# Altium schematic sheet Camera.SchDoc
size 594 x 420 mm; Address1: Address1; Address2: Address2; Address3: Address3; Address4: Address4; SheetNumber: 10; SheetTotal: 11; Scale: 1:1; Обозначение документа: Camera-Sensor-Project; Номер листа: 10
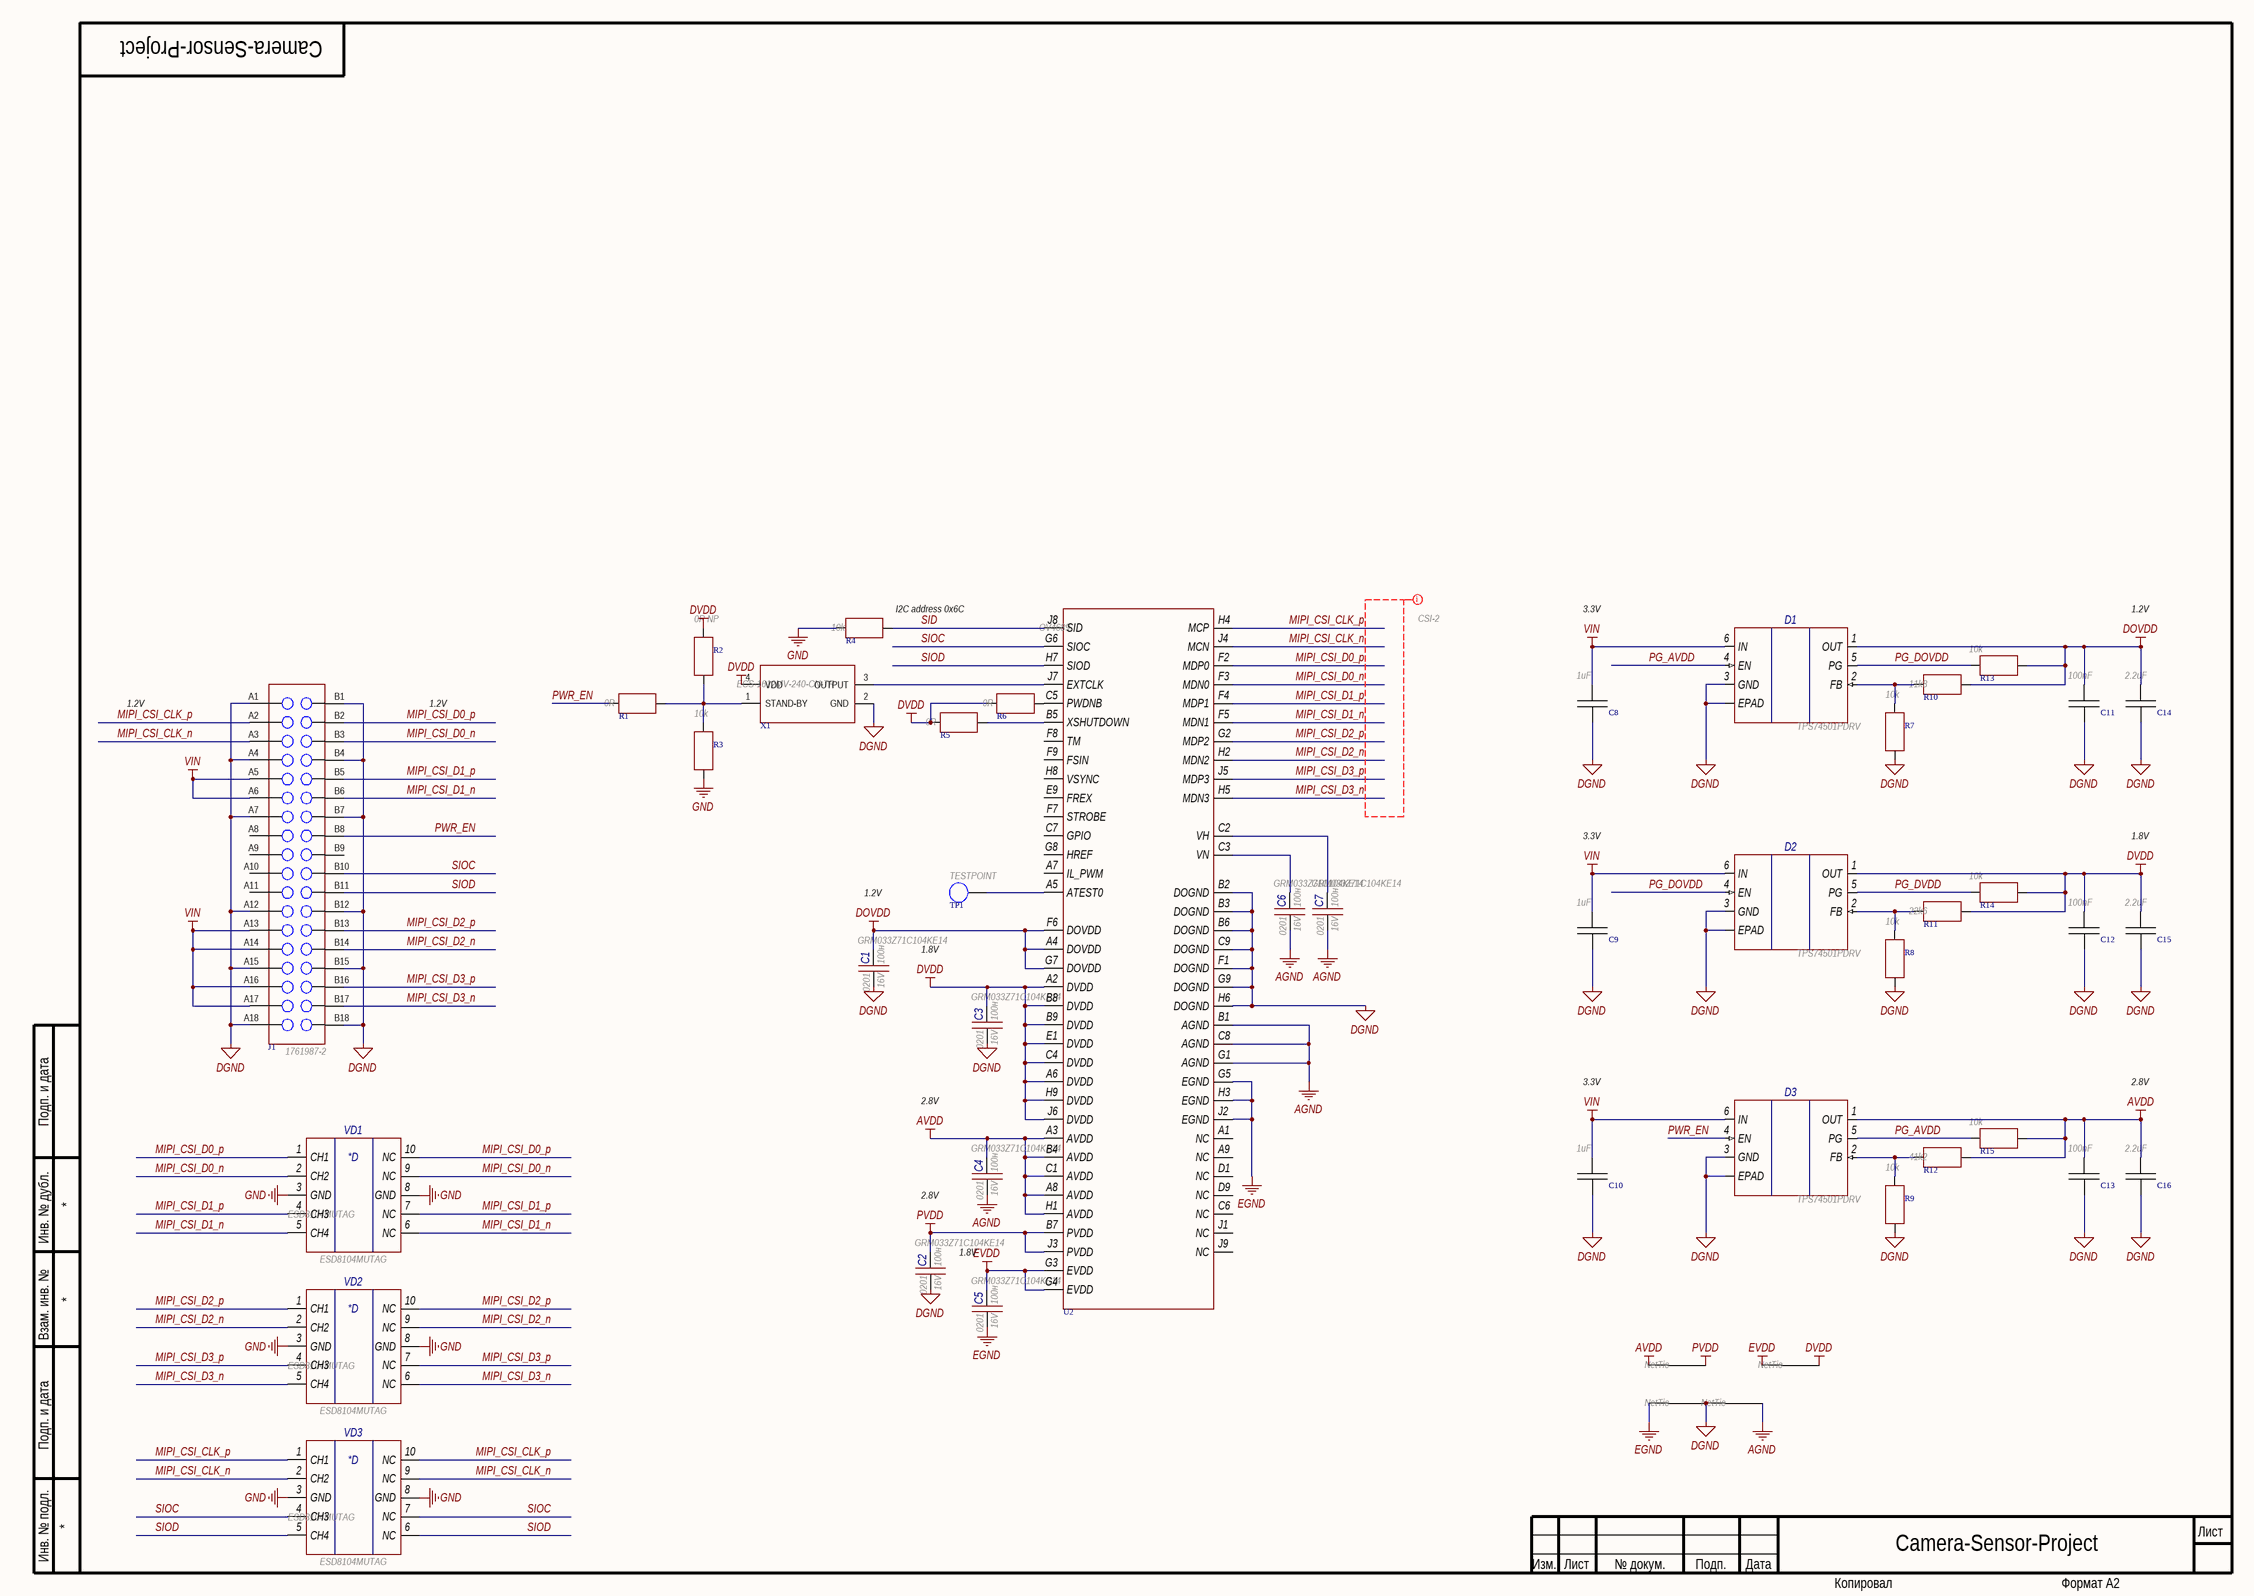
[diagram p0: Camera.SchDoc]

## Parts
C1  GRM033Z71C104KE14  2) Package: 0201  3) Voltage: 16V  Значение: 100н  [CAPC_0.63x0.33x0.33Body; IPC: N; Pad Gap: 0.25]
C2  GRM033Z71C104KE14  2) Package: 0201  3) Voltage: 16V  Значение: 100н  [CAPC_0.63x0.33x0.33Body; IPC: N; Pad Gap: 0.25]
C3  GRM033Z71C104KE14  2) Package: 0201  3) Voltage: 16V  Значение: 100н  [CAPC_0.63x0.33x0.33Body; IPC: N; Pad Gap: 0.25]
C4  GRM033Z71C104KE14  2) Package: 0201  3) Voltage: 16V  Значение: 100н  [CAPC_0.63x0.33x0.33Body; IPC: N; Pad Gap: 0.25]
C5  GRM033Z71C104KE14  2) Package: 0201  3) Voltage: 16V  Значение: 100н  [CAPC_0.63x0.33x0.33Body; IPC: N; Pad Gap: 0.25]
C6  GRM033Z71C104KE14  2) Package: 0201  3) Voltage: 16V  Значение: 100н  [CAPC_0.63x0.33x0.33Body; IPC: N; Pad Gap: 0.25]
C7  GRM033Z71C104KE14  2) Package: 0201  3) Voltage: 16V  Значение: 100н  [CAPC_0.63x0.33x0.33Body; IPC: N; Pad Gap: 0.25]
C8  1uF  [C0603]
C9  1uF  [C0603]
C10  1uF  [C0603]
C11  100nF  [C0603]
C12  100nF  [C0603]
C13  100nF  [C0603]
C14  2.2uF  [C0603]
C15  2.2uF  [C0603]
C16  2.2uF  [C0603]
D1  TPS74501PDRV  [WSON6_2.1x2.1x0.8Body; Recommended: Texas Instruments]
D2  TPS74501PDRV  [WSON6_2.1x2.1x0.8Body; Recommended: Texas Instruments]
D3  TPS74501PDRV  [WSON6_2.1x2.1x0.8Body; Recommended: Texas Instruments]
J1  1761987-2  [CON: 36_1761987-2_TEC]
JT1  NetTie  [CON: nettie_0.8]  (net tie, no BOM)
JT2  NetTie  [CON: nettie_0.8]  (net tie, no BOM)
JT3  NetTie  [CON: nettie_0.8]  (net tie, no BOM)
JT4  NetTie  [CON: nettie_0.8]  (net tie, no BOM)
R1  0R  [R0603]
R2  0R NP  [R0603]
R3  10k  [R0603]
R4  10k  [R0603]
R5  0R  [R0603]
R6  0R  [R0603]
R7  10k  [R0603]
R8  10k  [R0603]
R9  10k  [R0603]
R10  11k8  [R0603]
R11  22k6  [R0603]
R12  41k2  [R0603]
R13  10k  [R0603]
R14  10k  [R0603]
R15  10k  [R0603]
TP1  TESTPOINT  [TP]
U2  OV4689  [81-BGA-OMNIVISION4669]
VD1  ESD8104MUTAG  [UDFN10_1.0x2.5x0.55Body; Recommended: onsemi]
VD2  ESD8104MUTAG  [UDFN10_1.0x2.5x0.55Body; Recommended: onsemi]
VD3  ESD8104MUTAG  [UDFN10_1.0x2.5x0.55Body; Recommended: onsemi]
X1  ECS-1612MV-240-CN-TR  [DFN1.6X1.2]

## Nets
AGND: C4.1 C6.1 C7.1 JT3.2 U2.B1(AGND) U2.C8(AGND) U2.G1(AGND)
AVDD: C4.2 C13.2 C16.2 D3.1(OUT) JT1.1 R12.2 R15.1 U2.A3(AVDD) U2.A8(AVDD) U2.B4(AVDD) U2.C1(AVDD) U2.H1(AVDD)
DGND: C1.1 C2.1 C3.1 C8.1 C9.1 C10.1 C11.1 C12.1 C13.1 C14.1 C15.1 C16.1 D1.3(GND) D1.EPAD D2.3(GND) D2.EPAD D3.3(GND) D3.EPAD J1.A1 J1.A4 J1.A7 J1.A12 J1.A15 J1.A18 J1.B1 J1.B4 J1.B7 J1.B12 J1.B15 J1.B18 JT2.2 JT3.1 R7.1 R8.1 R9.1 U2.B2(DOGND) U2.B3(DOGND) U2.B6(DOGND) U2.C9(DOGND) U2.F1(DOGND) U2.G9(DOGND) U2.H6(DOGND) X1.2(GND)
DOVDD: C1.2 C11.2 C14.2 D1.1(OUT) R10.2 R13.1 U2.A4(DOVDD) U2.F6(DOVDD) U2.G7(DOVDD)
DVDD: C3.2 C12.2 C15.2 D2.1(OUT) JT4.2 R2.2 R5.1 R6.1 R11.2 R14.1 U2.A2(DVDD) U2.A6(DVDD) U2.B8(DVDD) U2.B9(DVDD) U2.C4(DVDD) U2.E1(DVDD) U2.H9(DVDD) U2.J6(DVDD) X1.4(VDD)
EGND: C5.1 JT2.1 U2.G5(EGND) U2.H3(EGND) U2.J2(EGND)
EVDD: C5.2 JT4.1 U2.G3(EVDD) U2.G4(EVDD)
GND: R3.1 R4.1 VD1.3(GND) VD1.8(GND) VD2.3(GND) VD2.8(GND) VD3.3(GND) VD3.8(GND)
PVDD: C2.2 JT1.2 U2.B7(PVDD) U2.J3(PVDD)
VIN: C8.2 C9.2 C10.2 D1.6(IN) D2.6(IN) D3.6(IN) J1.A5 J1.A6 J1.A13 J1.A14 J1.A16 J1.A17
MIPI_CSI_CLK_n: J1.A3 U2.J4(MCN) VD3.2(CH2) VD3.9(NC)
MIPI_CSI_CLK_p: J1.A2 U2.H4(MCP) VD3.1(CH1) VD3.10(NC)
MIPI_CSI_D0_n: J1.B3 U2.F3(MDN0) VD1.2(CH2) VD1.9(NC)
MIPI_CSI_D0_p: J1.B2 U2.F2(MDP0) VD1.1(CH1) VD1.10(NC)
MIPI_CSI_D1_n: J1.B6 U2.F5(MDN1) VD1.5(CH4) VD1.6(NC)
MIPI_CSI_D1_p: J1.B5 U2.F4(MDP1) VD1.4(CH3) VD1.7(NC)
MIPI_CSI_D2_n: J1.B14 U2.H2(MDN2) VD2.2(CH2) VD2.9(NC)
MIPI_CSI_D2_p: J1.B13 U2.G2(MDP2) VD2.1(CH1) VD2.10(NC)
MIPI_CSI_D3_n: J1.B17 U2.H5(MDN3) VD2.5(CH4) VD2.6(NC)
MIPI_CSI_D3_p: J1.B16 U2.J5(MDP3) VD2.4(CH3) VD2.7(NC)
PG_AVDD: D1.4(EN) D3.5(PG) R15.2
PG_DOVDD: D1.5(PG) D2.4(EN) R13.2
PG_DVDD: D2.5(PG) R14.2
PWR_EN: D3.4(EN) J1.B8 R1.1
SID: R4.2 U2.J8(SID)
SIOC: J1.B10 U2.G6(SIOC) VD3.4(CH3) VD3.7(NC)
SIOD: J1.B11 U2.H7(SIOD) VD3.5(CH4) VD3.6(NC)
NetC6_2: C6.2 U2.C3(VN)
NetC7_2: C7.2 U2.C2(VH)
NetD1_2: D1.2(FB) R7.2 R10.1
NetD2_2: D2.2(FB) R8.2 R11.1
NetD3_2: D3.2(FB) R9.2 R12.1
NetR1_2: R1.2 R2.1 R3.2 X1.1(STAND-BY)
NetR5_2: R5.2 U2.B5(XSHUTDOWN)
NetR6_2: R6.2 U2.C5(PWDNB)
NetTP1_1: TP1.1 U2.A5(ATEST0)
NetU2_J7: U2.J7(EXTCLK) X1.3(OUTPUT)

Not connected (* = marked no-connect by the designer): J1 A8 A9 A10 A11 B9; U2 A1(NC) A7(IL_PWM) A9(NC) C6(NC) C7(GPIO) D1(NC) D9(NC) E9(FREX) F7(STROBE) F8(TM) F9(FSIN) G8(HREF) H8(VSYNC) J1(NC) J9(NC)

## Layout directives
differential pair; differential pair class CSI-2; rule Matched Net Lengths [Delay Tolerance = 10ps]; rule Matched Net Lengths [Delay Tolerance = 1ps]: MIPI_CSI_CLK_n, MIPI_CSI_CLK_p, MIPI_CSI_D0_n, MIPI_CSI_D0_p, MIPI_CSI_D1_n, MIPI_CSI_D1_p, MIPI_CSI_D2_n, MIPI_CSI_D2_p, MIPI_CSI_D3_n, MIPI_CSI_D3_p

## Notes on the sheet
- (near R4) I2C address 0x6C
- 3.3V
- 1.2V
- 1.8V
- 2.8V
- (near C2) 1.8V
- Подп. и дата
- Инв. № дубл.
- Взам. инв. №
- Инв. № подл.
- Изм.
- Лист
- № докум.
- Подп.
- Дата
- Копировал
- Формат А2
- (in symbol VCH_CMP_PROT_0000010-15) *D

## Library data of the parts
C1-C7 = VCH_CMP_CAP_0000489-24: N/A; Manufacturer: Murata; Value: 100nF; 1) Ta max: 125°C; 1) Ta min: -55°C; 2) Height max: 330µm; 2) Length max: 630µm; 4) Dielectric: X7R; 4) Note: Derating1。 Temperature characteristic : Range of capacitance change rate is specified with 50% of rated voltage.; 3) Tolerance [%]: 10%; 5) Application: General Purpose; Part Number: GRM033Z71C104KE14; 2) Width max: 330µm
C8-C10 = Cap 1uF 10% 16V_Samsung: Manufacture: Samsung Electro-Mechanics; Model: CL10B105KO8NNNC; Tolerance: 10%; Voltage: 16V; HelpURL: https://www.digikey.com/product-detail/en/samsung-electro-mechanics/CL10B105KO8NNNC/1276-1019-1-ND/3889105; Case: 0603; Value: 1uF; Part Number: CL10B105KO8NNNC
C11-C13 = Cap 100nF 20% 25V: Manufacture: AVX Corporation; Model: 06033G104ZAT2A; Tolerance: +80% -20%; Voltage: 25V; HelpURL: https://ru.farnell.com/avx/06033g104zat2a/cap-0-1-f-25v-y5v-0603/dp/317287?ost=317-287; Case: 0603; Value: 100nF; Part Number: 06033G104ZAT2A
C14-C16 = Cap 2.2uF 10% 6.3V: Manufacture: AVX Corporation; Model: 06036D225KAT2A; Tolerance: 10%; Voltage: 6.3V; HelpURL: https://www.digikey.com/products/en?keywords=478-1252-2-ND; Case: 0603; Value: 2.2uF; Part Number: 06036D225KAT2A
D1-D3 = VCH_CMP_IC_0000046-20: IC REG LIN POS ADJ 500MA 6WSON; Manufacturer: Texas Instruments; 1) Rθja max: 80.3°C; 2) Package: WSON6; 3) Vin min: 1.5V; 4) Number of Regulators: 1; 2) Length max: 2.1mm; 3) Vout max: 5.5V; 3) Ignd @Iout max @25°C: 31µA; 1) Tj min: -40°C; 2) Height max: 800µm; 3) Vin max: 6V; 3) Vout min: 550mV; 3) Vdo @Iout max @25°C: 880mV; 1) Tj max: 125°C; 3) Vn [V]: 53µV; Part Number: TPS74501PDRV; ComponentLink1URL: https://www.ti.com/product/TPS745; ComponentLink1Description: URL Manufacturer; 3) Iout max @25°C: 500mA; 2) Width max: 2.1mm
J1 = 1761987-2: CONN MINI SAS RCP 36P SLD RA SMD; Manufacture: TE Connectivity; Case: SMD; Model: 1761987-2; ComponentLink1Description: Datasheet
JT1-JT4 = NetTie: Manufacture: Bourns; Model: BAV74; Case: SOT-23; HelpURL: https://www.compel.ru/item-pdf/3da40dc7a4ab42364bbe129f36a2cb8d/ps/bourns~7914.pdf
R1 R5 R6 = Res 0R OHM 0603: Part Number: P0.0GDKR-ND; Manufacture: Panasonic Electronic Components; Tolerance: 5%; Model: ERJ-3GEY0R00V; HelpURL: https://www.digikey.com/en/products/detail/panasonic-electronic-components/ERJ-3GEY0R00V/577612; Case: 0603; Value: 0R
R2 = Res 0R NP 1% 0603: Tolerance: 1%; Case: 0603; Value: 0R NP
R3 R4 R7-R9 R13-R15 = Res 10k 1% 0603: Part Number: P10.0KHTR-ND; Manufacture: Panasonic Electronic Components; Tolerance: 1%; Model: ERJ-3EKF1002V; HelpURL: https://www.digikey.com/en/products/detail/ERJ-3EKF1002V/P10.0KHCT-ND/198102; Case: 0603; Value: 10k
R10 = Res 11k8 1% 0603: Manufacture: Yageo; Tolerance: 1%; Model: RC0603FR-0711K8L; HelpURL: https://www.electronshik.ru/item/YAG/RC0603FR-0711K8L; Case: 0603; Value: 11k8
R11 = Res 22k6 1% 0603: Manufacture: Yageo; Tolerance: 1%; Model: RC0603FR-0722K6L; HelpURL: https://www.electronshik.ru/item/YAG/RC0603FR-0722K6L; Case: 0603; Value: 22k6
R12 = Res 41k2 1% 0603: Manufacture: Yageo; Tolerance: 1%; Model: RC0603FR-0741K2L; HelpURL: https://www.electronshik.ru/item/YAG/RC0603FR-0741K2L; Case: 0603; Value: 41k2
U2 = OV4689: IMAGE SENSOR 4MP 1/3 CIS SO81-BGA; Manufacture: OMNIVISION; Model: OV4689; Value: OV4689; ComponentLink1Description: Datasheet; ComponentLink1URL: https://www.st.com/resource/en/datasheet/stm32f407vg.pdf
VD1-VD3 = VCH_CMP_PROT_0000010-15: Manufacturer: onsemi; 1) Tj max: 125°C; 1) Tj min: -55°C; 2) Height max: 550µm; 2) Length max: 1mm; 2) Width max: 2.5mm; 3) IEC-61000-4-2 Contact: 8kV; 4) Note: Flow−Through Style; 3) C max @25°: 0.37pF; 3) Ipp @Vcl @25°: 16A; 3) Ir @Vr @25°: 1µA; 3) It @Vbr @25°: 1mA; 3) Vbr min @25°: 4V; 3) Vcl max @25°: 11.4V; 3) Vr min @25°: 3.3V; 5) Mounting: SMT; 5) Package: UDFN10; 6) Bidirectional Channels: 0; 6) Unidirectional Channels: 4; 7) Application: USB 3.0/3.1, eSATA, HDMI 1.3/1.4/2.0, DisplayPort; Part Number: ESD8104MUTAG; ComponentLink1Description: URL Manufacturer; ComponentLink1URL: https://www.onsemi.com/products/discrete-power-modules/esd-protection-diodes/esd8104
X1 = ECS-1612MV-240-CN-TR: XTAL OSC XO 24.0000MHZ CMOS SMD; Manufacture: ECS; Case: DFN1.6X1.2; Model: ECS-1612MV-240-CN-TR; ComponentLink1Description: Datasheet